# Altium schematic sheet machnld.SchDoc
size A4
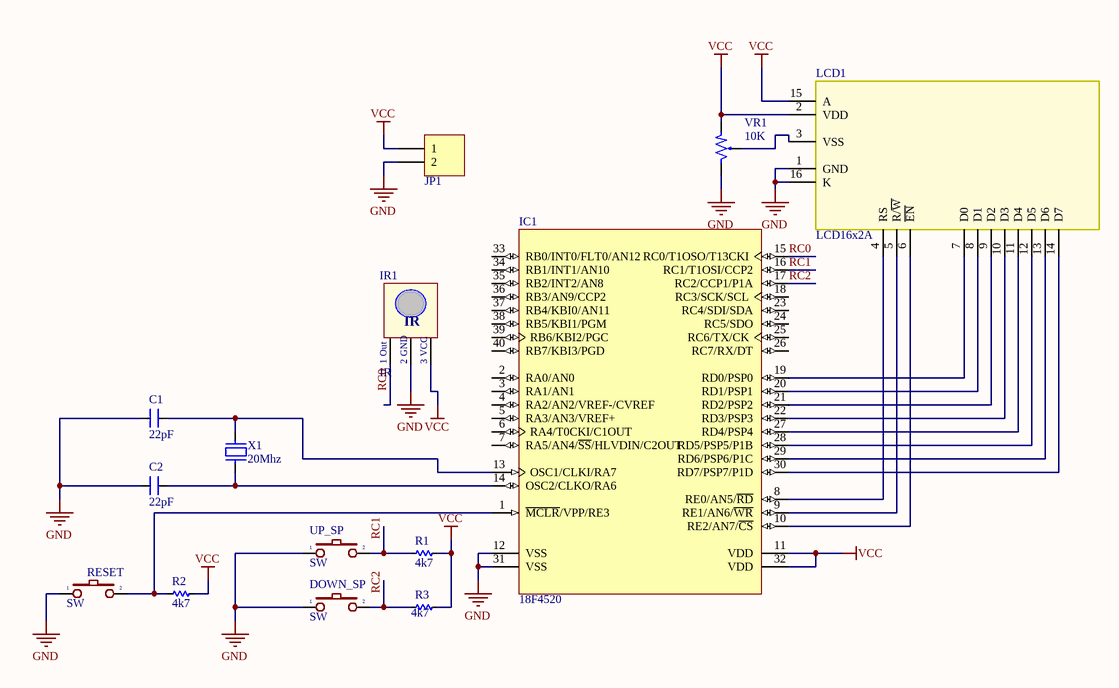
[diagram p0: machnld.SchDoc]

## Parts
C1  22pF  [CN1.5]
C2  22pF  [CN1.5]
DOWN_SP  SW  [SW2]
IC1  18F4520  [DIP40/W0.6]
IR1  IR  [JP3-C1T]
JP1  Header 2_1  [HED2]  (value not drawn)
LCD1  LCD16x2A  [LCD16X2]
R1  4k7  [RES-1/2W]
R2  4k7  [RES-1/2W]
R3  4k7  [RES-1/2W]
RESET  SW  [SW2]
UP_SP  SW  [SW2]
VR1  10K  [VR]
X1  20Mhz  [XT2]

## Nets
GND: C1.2 C2.2 DOWN_SP.1 IC1.12(VSS) IC1.31(VSS) IR1.2(GND) JP1.2 LCD1.1(GND) LCD1.16(K) RESET.1 UP_SP.1 VR1.3
VCC: IC1.11(VDD) IC1.32(VDD) IR1.3(VCC) JP1.1 LCD1.2(VDD) LCD1.15(A) R1.1 R2.1 R3.1 VR1.1
RC0: IC1.15(RC0/T1OSO/T13CKI) IR1.1(Out)
RC1: IC1.16(RC1/T1OSI/CCP2) R1.2 UP_SP.2
RC2: DOWN_SP.2 IC1.17(RC2/CCP1/P1A) R3.2
NetC1_1: C1.1 IC1.13(OSC1/CLKI/RA7) X1.2
NetC2_1: C2.1 IC1.14(OSC2/CLKO/RA6) X1.1
NetIC1_1: IC1.1(~{MCLR}/VPP/RE3) R2.2 RESET.2
NetIC1_8: IC1.8(RE0/AN5/~{RD}) LCD1.4(RS)
NetIC1_9: IC1.9(RE1/AN6/~{WR}) LCD1.5(R/~{W})
NetIC1_10: IC1.10(RE2/AN7/~{CS}) LCD1.6(~{EN})
NetIC1_19: IC1.19(RD0/PSP0) LCD1.7(D0)
NetIC1_20: IC1.20(RD1/PSP1) LCD1.8(D1)
NetIC1_21: IC1.21(RD2/PSP2) LCD1.9(D2)
NetIC1_22: IC1.22(RD3/PSP3) LCD1.10(D3)
NetIC1_27: IC1.27(RD4/PSP4) LCD1.11(D4)
NetIC1_28: IC1.28(RD5/PSP5/P1B) LCD1.12(D5)
NetIC1_29: IC1.29(RD6/PSP6/P1C) LCD1.13(D6)
NetIC1_30: IC1.30(RD7/PSP7/P1D) LCD1.14(D7)
NetLCD1_3: LCD1.3(VSS) VR1.2

Not connected (* = marked no-connect by the designer): IC1 2(RA0/AN0) 3(RA1/AN1) 4(RA2/AN2/VREF-/CVREF) 5(RA3/AN3/VREF+) 6(RA4/T0CKI/C1OUT) 7(RA5/AN4/~{SS}/HLVDIN/C2OUT) 18(RC3/SCK/SCL) 23(RC4/SDI/SDA) 24(RC5/SDO) 25(RC6/TX/CK) 26(RC7/RX/DT) 33(RB0/INT0/FLT0/AN12) 34(RB1/INT1/AN10) 35(RB2/INT2/AN8) 36(RB3/AN9/CCP2) 37(RB4/KBI0/AN11) 38(RB5/KBI1/PGM) 39(RB6/KBI2/PGC) 40(RB7/KBI3/PGD)

## Notes on the sheet
- (in symbol IR) 1 Out; 2 GND; 3 VCC

## Library data of the parts
C1 C2 = CN1.5: Cap np 682pF => 104pF; Value: 0.01uF
DOWN_SP RESET UP_SP = SW2: Switch button 2 pin; Value: SW chip 2 pin
IC1 = 18F4520: 32KB Flash, 1536B RAM, 256B EFROM, 40-Pin PDIP; Value: DIP 40; Value: 18F4520; Copyright by: VanDungEvn
IR1 = IR: Receiver Infraed IC
JP1 = Header 2_1: Header, 2-Pin; Manufacturer: Generic Components; Class: Connector; Value: Header 2
LCD1 = LCD16x2: LCD dipslay 16 char, 2 line; Value: LCD16x2A
R1-R3 = Res: Manufacturer: Generic Components; Class: Passive; SubClass: R; Published: 08/06/2000; Publisher: Altium Hobart Technology Centre
VR1 = VR1: Var Resistor; Value: VR 10K
X1 = XT2: Crystal For all Crystal 2pin.; Value: 4Mhz